# EAGLE design working (EAGLE 6.3)
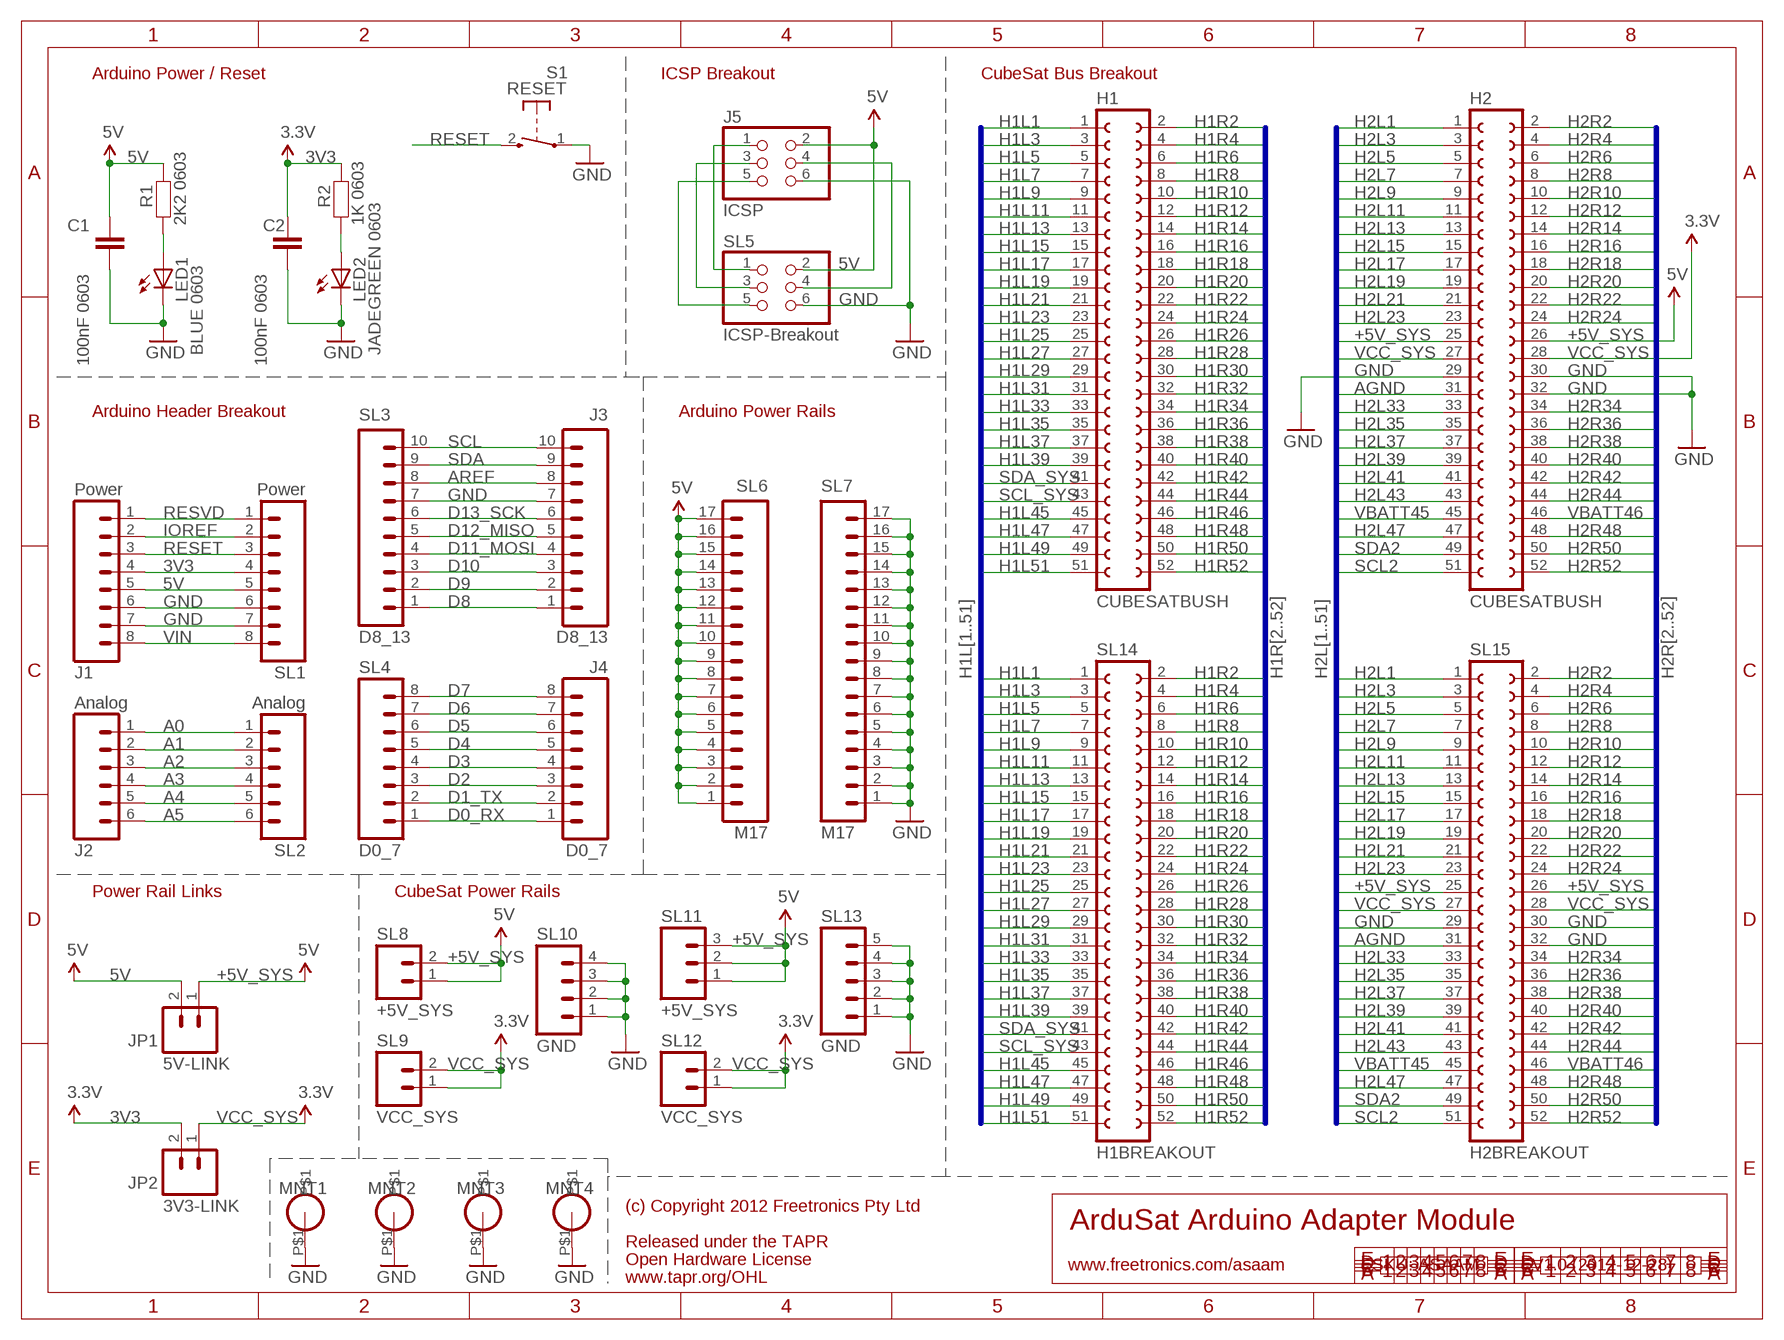
[diagram p0: schematic, sheet 1]

## Parts
C1  100nF 0603  CAP0603  [0603]
C2  100nF 0603  CAP0603  [0603]
H1  CUBESATBUSH  [CUBESATBUS]
H2  CUBESATBUSH  [CUBESATBUS]
J1  Power  M08STD  [1X08]
J2  Analog  M06SIP  [1X06]
J3  D8_13  M100.1  [1X10]
J4  D0_7  M08STD  [1X08]
J5  ICSP  ICSPPTH  [2X03PTH]
JP1  5V-LINK  M02PTH  [1X02]
JP2  3V3-LINK  M02PTH  [1X02]
LED1  BLUE 0603  LED0603  [LED-0603]
LED2  JADEGREEN 0603  LED0603  [LED-0603]
MNT1  HOLE3.2MM  [HOLE32]
MNT2  HOLE3.2MM  [HOLE32]
MNT3  HOLE3.2MM  [HOLE32]
MNT4  HOLE3.2MM  [HOLE32]
R1  2K2 0603  RESISTOR0603  [0603]
R2  1K 0603  RESISTOR0603  [0603]
S1  RESET  TAC_SWITCH_2PIN  [TACTILE_SWITCH_SMD_2PIN_TINY]
SL1  Power  M08STD  [1X08]
SL2  Analog  M06SIP  [1X06]
SL3  D8_13  M100.1  [1X10]
SL4  D0_7  M08STD  [1X08]
SL5  ICSP-Breakout  ICSPPTH  [2X03PTH]
SL6  M17  [1X17]
SL7  M17  [1X17]
SL8  +5V_SYS  M02PTH  [1X02]
SL9  VCC_SYS  M02PTH  [1X02]
SL10  GND  M04PTH  [1X04]
SL11  +5V_SYS  M03PTH  [1X03]
SL12  VCC_SYS  M02PTH  [1X02]
SL13  GND  M05PTH  [1X05]
SL14  H1BREAKOUT  CUBESATBUSH  [CUBESATBUS]
SL15  H2BREAKOUT  CUBESATBUSH  [CUBESATBUS]

## Nets
3V3: C2.1 J1.4 JP2.2 R2.1 SL1.4 ; supply symbol labelled 3.3V
5V: C1.1 J1.5 J5.2 JP1.2 R1.1 SL1.5 SL5.2 SL6.1 SL6.2 SL6.3 SL6.4 SL6.5 SL6.6 SL6.7 SL6.8 SL6.9 SL6.10 SL6.11 SL6.12 SL6.13 SL6.14 SL6.15 SL6.16 SL6.17
+5V_SYS: H2.25 H2.26 JP1.1 SL8.1 SL8.2 SL11.1 SL11.2 SL11.3 SL15.25 SL15.26 ; supply symbol labelled 5V
A0: J2.1 SL2.1
A1: J2.2 SL2.2
A2: J2.3 SL2.3
A3: J2.4 SL2.4
A4: J2.5 SL2.5
A5: J2.6 SL2.6
AGND: H2.31 SL15.31
AREF: J3.8 SL3.8
D0_RX: J4.1 SL4.1
D1_TX: J4.2 SL4.2
D2: J4.3 SL4.3
D3: J4.4 SL4.4
D4: J4.5 SL4.5
D5: J4.6 SL4.6
D6: J4.7 SL4.7
D7: J4.8 SL4.8
D8: J3.1 SL3.1
D9: J3.2 SL3.2
D10: J3.3 SL3.3
D11_MOSI: J3.4 SL3.4
D12_MISO: J3.5 SL3.5
D13_SCK: J3.6 SL3.6
GND: C1.2 C2.2 H2.29 H2.30 H2.32 J1.6 J1.7 J3.7 J5.6 LED1.C LED2.C MNT1.P$1 MNT2.P$1 MNT3.P$1 MNT4.P$1 S1.1(P) SL1.6 SL1.7 SL3.7 SL5.6 SL7.1 SL7.2 SL7.3 SL7.4 SL7.5 SL7.6 SL7.7 SL7.8 SL7.9 SL7.10 SL7.11 SL7.12 SL7.13 SL7.14 SL7.15 SL7.16 SL7.17 SL10.1 SL10.2 SL10.3 SL10.4 SL13.1 SL13.2 SL13.3 SL13.4 SL13.5 SL15.29 SL15.30 SL15.32
H1L1: H1.1 SL14.1
H1L3: H1.3 SL14.3
H1L5: H1.5 SL14.5
H1L7: H1.7 SL14.7
H1L9: H1.9 SL14.9
H1L11: H1.11 SL14.11
H1L13: H1.13 SL14.13
H1L15: H1.15 SL14.15
H1L17: H1.17 SL14.17
H1L19: H1.19 SL14.19
H1L21: H1.21 SL14.21
H1L23: H1.23 SL14.23
H1L25: H1.25 SL14.25
H1L27: H1.27 SL14.27
H1L29: H1.29 SL14.29
H1L31: H1.31 SL14.31
H1L33: H1.33 SL14.33
H1L35: H1.35 SL14.35
H1L37: H1.37 SL14.37
H1L39: H1.39 SL14.39
H1L45: H1.45 SL14.45
H1L47: H1.47 SL14.47
H1L49: H1.49 SL14.49
H1L51: H1.51 SL14.51
H1R2: H1.2 SL14.2
H1R4: H1.4 SL14.4
H1R6: H1.6 SL14.6
H1R8: H1.8 SL14.8
H1R10: H1.10 SL14.10
H1R12: H1.12 SL14.12
H1R14: H1.14 SL14.14
H1R16: H1.16 SL14.16
H1R18: H1.18 SL14.18
H1R20: H1.20 SL14.20
H1R22: H1.22 SL14.22
H1R24: H1.24 SL14.24
H1R26: H1.26 SL14.26
H1R28: H1.28 SL14.28
H1R30: H1.30 SL14.30
H1R32: H1.32 SL14.32
H1R34: H1.34 SL14.34
H1R36: H1.36 SL14.36
H1R38: H1.38 SL14.38
H1R40: H1.40 SL14.40
H1R42: H1.42 SL14.42
H1R44: H1.44 SL14.44
H1R46: H1.46 SL14.46
H1R48: H1.48 SL14.48
H1R50: H1.50 SL14.50
H1R52: H1.52 SL14.52
H2L1: H2.1 SL15.1
H2L3: H2.3 SL15.3
H2L5: H2.5 SL15.5
H2L7: H2.7 SL15.7
H2L9: H2.9 SL15.9
H2L11: H2.11 SL15.11
H2L13: H2.13 SL15.13
H2L15: H2.15 SL15.15
H2L17: H2.17 SL15.17
H2L19: H2.19 SL15.19
H2L21: H2.21 SL15.21
H2L23: H2.23 SL15.23
H2L33: H2.33 SL15.33
H2L35: H2.35 SL15.35
H2L37: H2.37 SL15.37
H2L39: H2.39 SL15.39
H2L41: H2.41 SL15.41
H2L43: H2.43 SL15.43
H2L47: H2.47 SL15.47
H2R2: H2.2 SL15.2
H2R4: H2.4 SL15.4
H2R6: H2.6 SL15.6
H2R8: H2.8 SL15.8
H2R10: H2.10 SL15.10
H2R12: H2.12 SL15.12
H2R14: H2.14 SL15.14
H2R16: H2.16 SL15.16
H2R18: H2.18 SL15.18
H2R20: H2.20 SL15.20
H2R22: H2.22 SL15.22
H2R24: H2.24 SL15.24
H2R34: H2.34 SL15.34
H2R36: H2.36 SL15.36
H2R38: H2.38 SL15.38
H2R40: H2.40 SL15.40
H2R42: H2.42 SL15.42
H2R44: H2.44 SL15.44
H2R48: H2.48 SL15.48
H2R50: H2.50 SL15.50
H2R52: H2.52 SL15.52
IOREF: J1.2 SL1.2
N$1: LED2.A R2.2
N$6: LED1.A R1.2
N$35: J5.4 SL5.4
N$51: J5.1 SL5.1
N$52: J5.3 SL5.3
N$53: J5.5 SL5.5
RESET: J1.3 S1.2(S) SL1.3
RESVD: J1.1 SL1.1
SCL: J3.10 SL3.10
SCL2: H2.51 SL15.51
SCL_SYS: H1.43 SL14.43
SDA: J3.9 SL3.9
SDA2: H2.49 SL15.49
SDA_SYS: H1.41 SL14.41
VBATT45: H2.45 SL15.45
VBATT46: H2.46 SL15.46
VCC_SYS: H2.27 H2.28 JP2.1 SL9.1 SL9.2 SL12.1 SL12.2 SL15.27 SL15.28 ; supply symbol labelled 3.3V
VIN: J1.8 SL1.8

## Buses
H1L[1..51]
H1R[2..52]
H2L[1..51]
H2R[2..52]

## Notes on the sheet
- Arduino Power / Reset | ICSP Breakout | CubeSat Bus Breakout
- Arduino Header Breakout | Arduino Power Rails
- Power Rail Links | CubeSat Power Rails
- (c) Copyright 2012 Freetronics Pty Ltd
- ArduSat Arduino Adapter Module
- Released under the TAPR
- Open Hardware License
- www.freetronics.com/asaam | SKU: ASAAM | V1.0 (2012-12-28)
- www.tapr.org/OHL

## Library data of the parts
C1 C2 = freetronics-master-v1.1:CAP: Capacitor Standard 0603 ceramic capacitor, and 0.1" leaded capacitor.
H1 H2 SL14 SL15 = freetronics-jon:CUBESATBUS
J1 J4 SL1 SL4 = freetronics-master-v1.1:M08: Header 8 Standard 8-pin 0.1" header. Use with straight break away headers (SKU : PRT-00116), right angle break away headers (PRT-00553), swiss pins (PRT-00743), machine pins (PRT-00117), and female headers (PRT-00115).
J2 SL2 = freetronics-master-v1.1:M06: Header 6 Standard 6-pin 0.1" header. Use with straight break away headers (SKU : PRT-00116), right angle break away headers (PRT-00553), swiss pins (PRT-00743), machine pins (PRT-00117), and female headers (PRT-00115). Molex polarized connector foot print use with SKU : PRT-08094 with associated crimp pins and housings. NOTES ON THE VARIANTS LOCK and LOCK_LONGPADS... This footprint was designed to help hold the alignment of a through-hole component (i.e. 6-pin header) while soldering it into place. You may notice that each hole has been shifted either up or down by 0.005 of an inch from it's more standard position (which is a perfectly straight line). This slight alteration caused the pins (the squares in the middle) to touch the edges of the holes. Because they are alternating, it causes a "brace" to hold the component in place. 0.005 has proven to be the perfect amount of "off-center" position when using our standard breakaway headers. Although looks a little odd when you look at the bare footprint, once you have a header in there, the alteration is very hard to notice. Also, if you push a header all the way into place, it is covered up entirely on the bottom side. This idea of altering the position of holes to aid alignment will be further integrated into the Sparkfun Library for other footprints. It can help hold any component with 3 or more connection pins.
J3 SL3 = freetronics-original:M10: Header 10 Standard 10-pin 0.1" header. Use with straight break away headers (SKU : PRT-00116), right angle break away headers (PRT-00553), swiss pins (PRT-00743), machine pins (PRT-00117), and female headers (PRT-00115).
J5 SL5 = freetronics-jon:ICSP
JP1 JP2 SL8 SL9 SL12 = freetronics-master-v1.1:M02: Header 2 Standard 2-pin 0.1" header. Use with straight break away headers (SKU : PRT-00116), right angle break away headers (PRT-00553), swiss pins (PRT-00743), machine pins (PRT-00117), and female headers (PRT-00115). Molex polarized connector foot print use with SKU : PRT-08233 with associated crimp pins and housings.
LED1 LED2 = freetronics-jon:LED: LEDs Standard schematic elements and footprints for 5mm, 3mm, 1206, and 0603 sized LEDs. 5mm - Spark Fun Electronics SKU : COM-00529 (and others)
MNT1-MNT4 = freetronics-jon:HOLE
R1 R2 = freetronics-master-v1.1:RESISTOR: Resistor Basic schematic elements and footprints for 0603, 1206, and PTH 1/10th watt (small) resistors.
S1 = freetronics-master-v1:TAC_SWITCH_2PIN: Momentary Tactile Switch - 2 pin
SL6 SL7 = freetronics-master-v1.1:M17
SL10 = freetronics-master-v1.1:M04: Header 4 Standard 4-pin 0.1" header. Use with straight break away headers (SKU : PRT-00116), right angle break away headers (PRT-00553), swiss pins (PRT-00743), machine pins (PRT-00117), and female headers (PRT-00115). Molex polarized connector foot print use with SKU : PRT-08231 with associated crimp pins and housings.
SL11 = freetronics-master-v1.1:M03: Header 3 Standard 3-pin 0.1" header. Use with straight break away headers (SKU : PRT-00116), right angle break away headers (PRT-00553), swiss pins (PRT-00743), machine pins (PRT-00117), and female headers (PRT-00115). Molex polarized connector foot print use with SKU : PRT-08232 with associated crimp pins and housings.
SL13 = freetronics-master-v1.1:M05: Header 5 Standard 5-pin 0.1" header. Use with straight break away headers (SKU : PRT-00116), right angle break away headers (PRT-00553), swiss pins (PRT-00743), machine pins (PRT-00117), and female headers (PRT-00115). Molex polarized connector foot print use with SKU : PRT-08230 with associated crimp pins and housings.

## Board
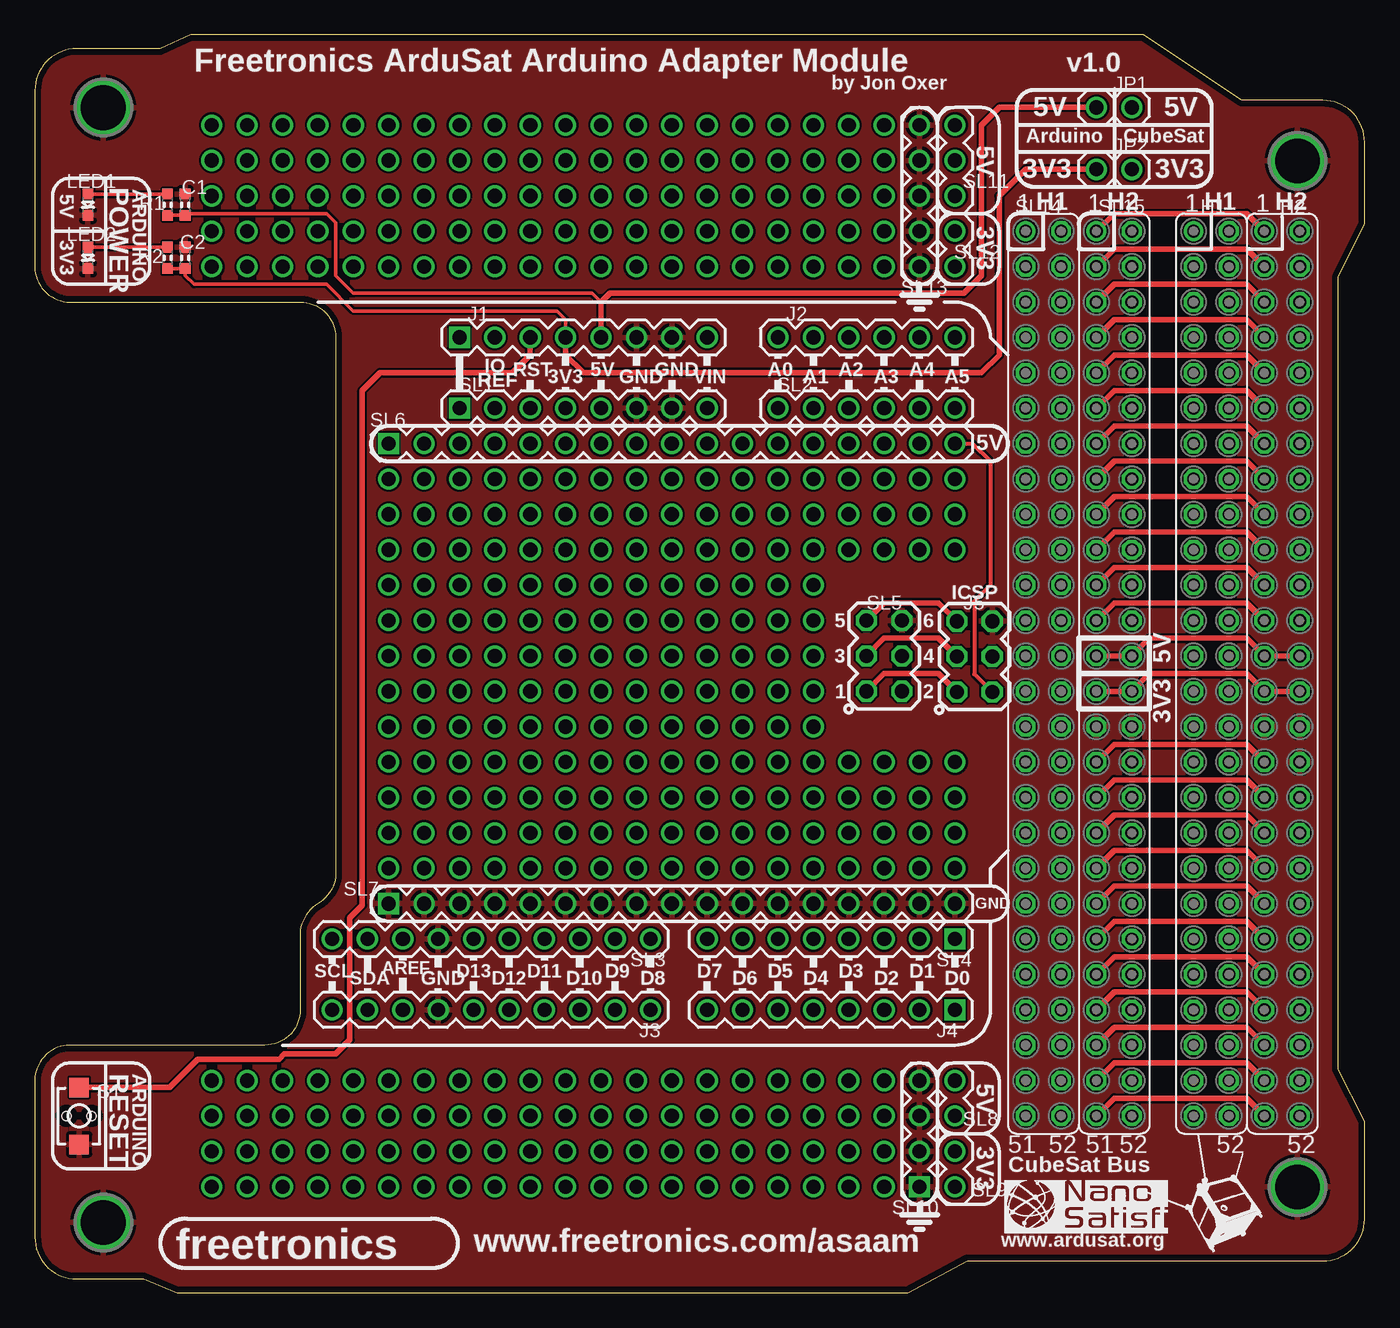
[diagram p1: board, top side]
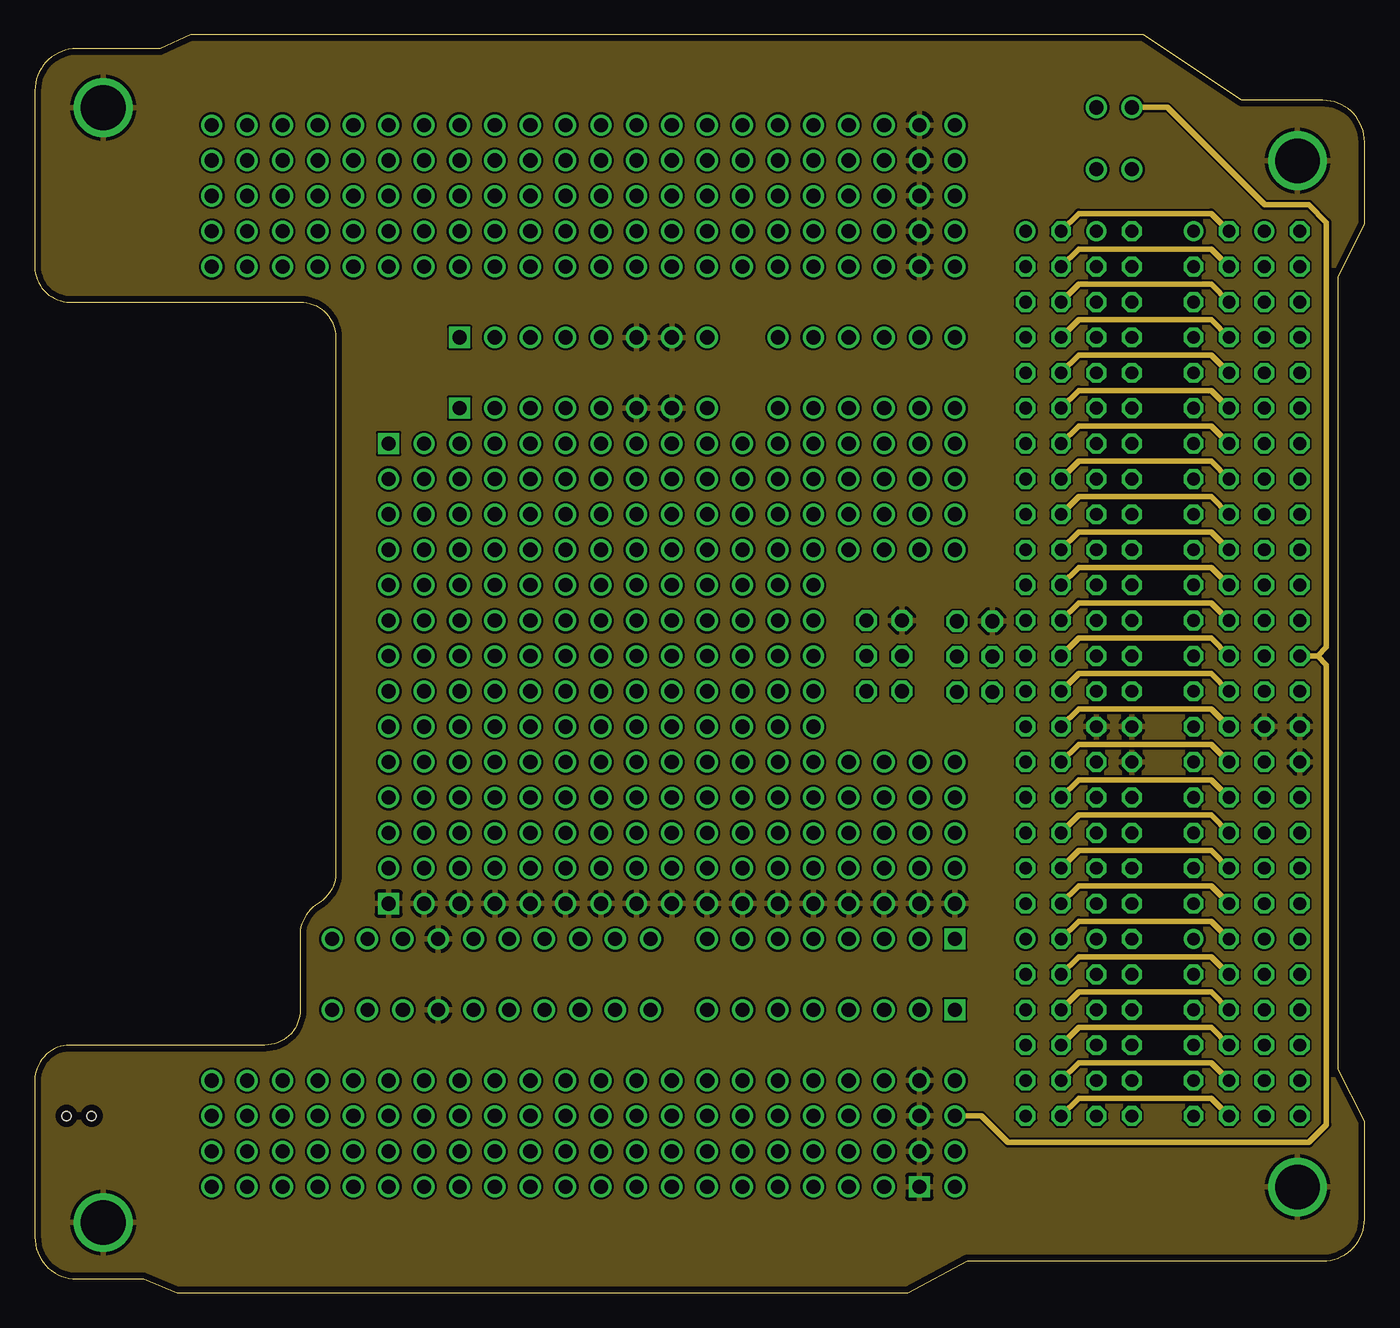
[diagram p2: board, inner layer Route2]
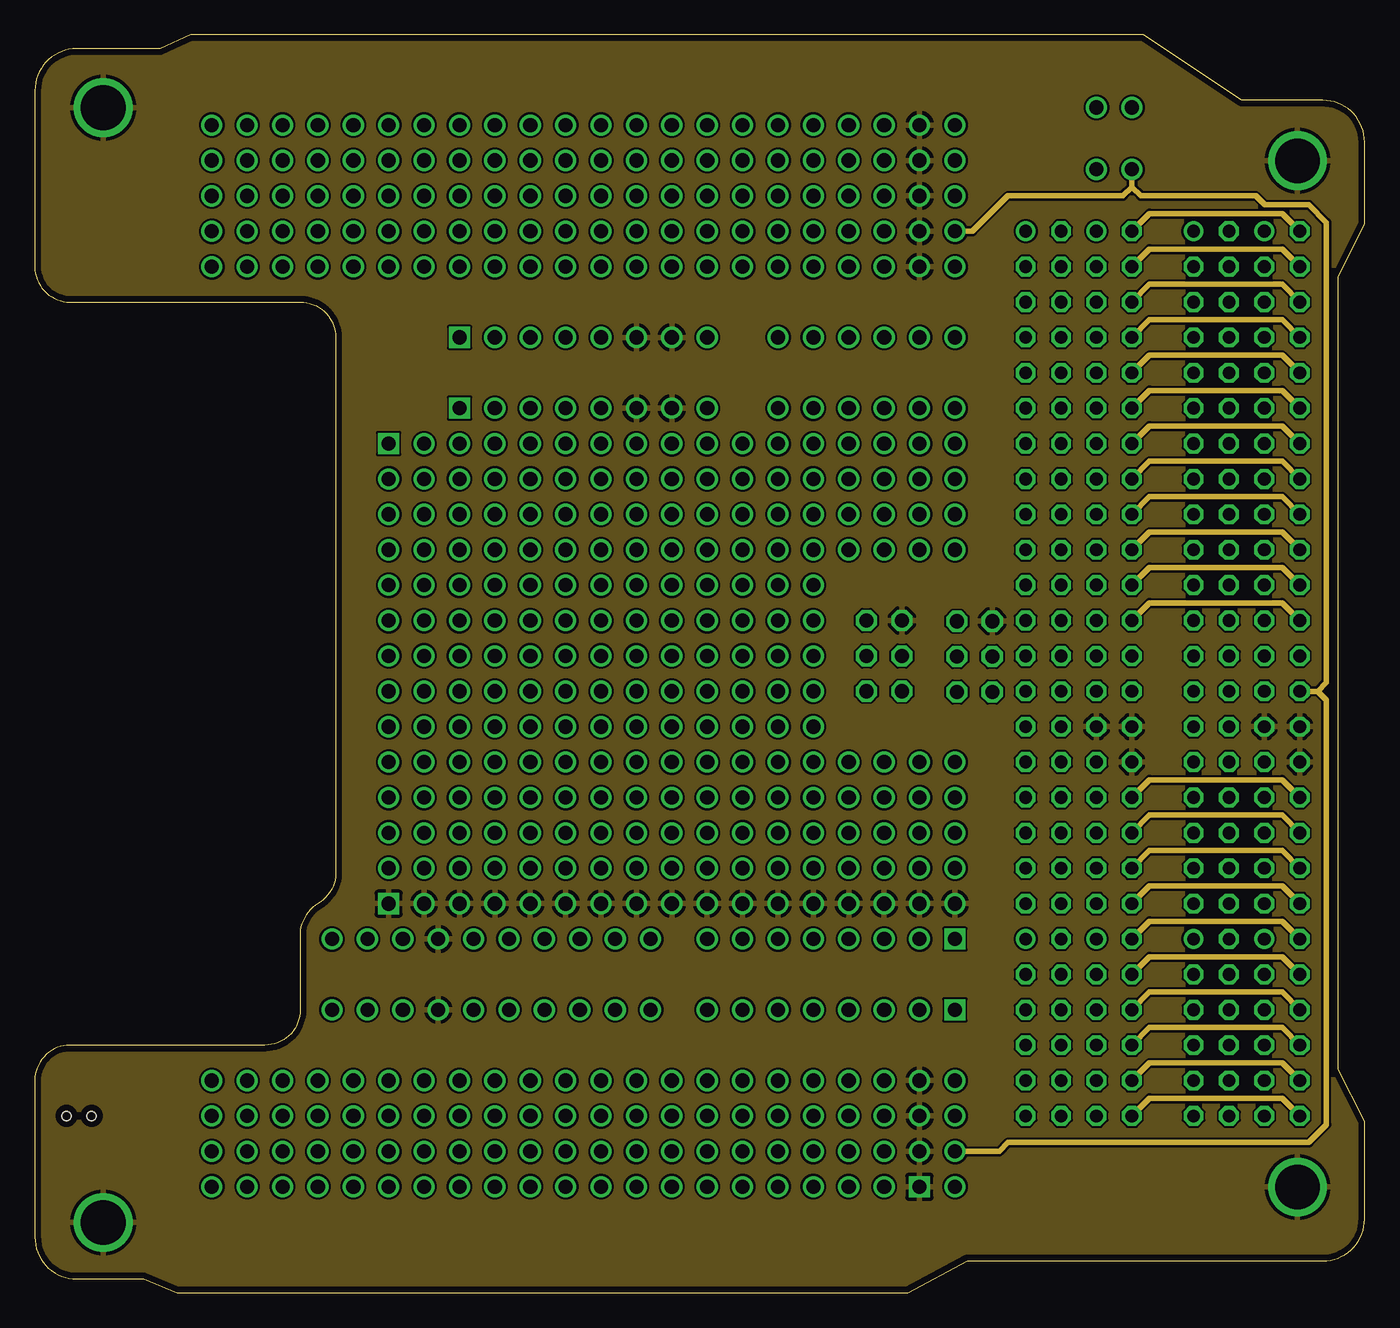
[diagram p3: board, inner layer Route15]
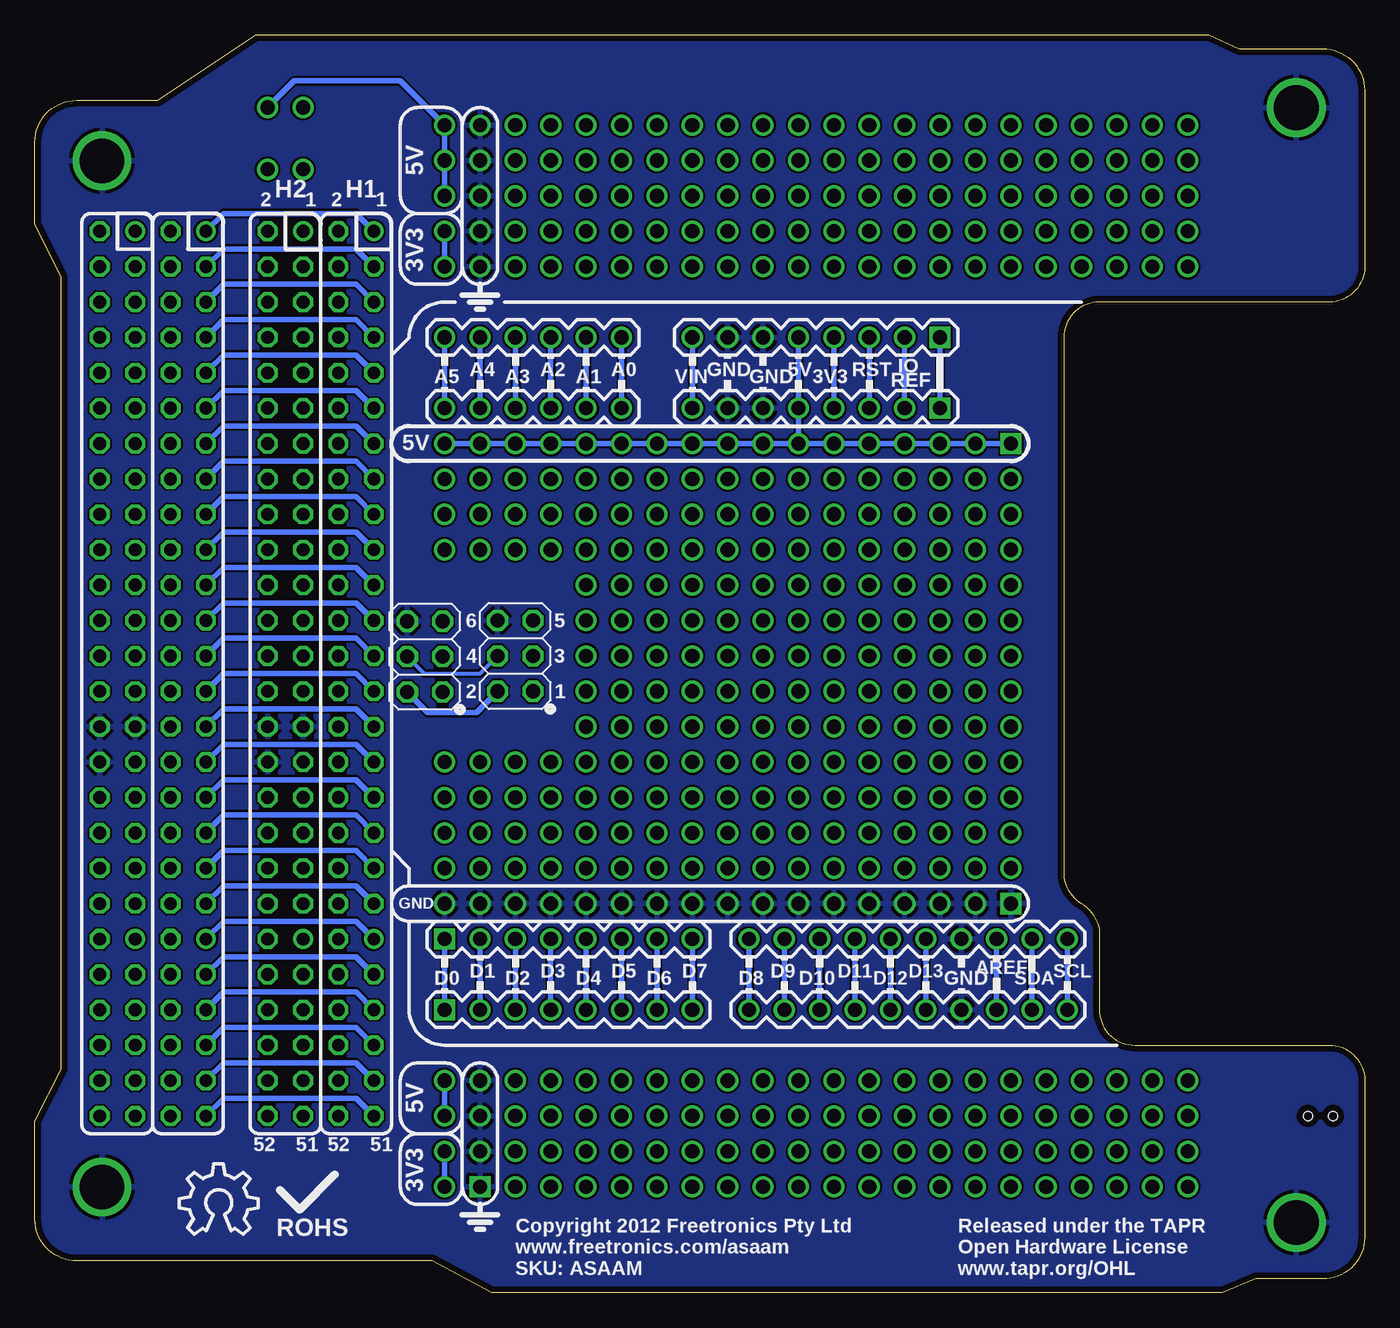
[diagram p4: board, bottom side, seen from below]

Size 95.45 x 90.3 mm. Coordinates in mm from the lower left corner, seen from the top.
Outline: 0,4 arc90 3,1 7.81,1 10.23,0 62.65,0 66.94,2.3 92.45,2.3 arc90 95.45,5.3 95.45,12.31 93.55,16.05 93.55,72.91 95.45,76.74 95.45,82.6 arc90 92.45,85.6 86.64,85.6 79.56,90.3 11.2,90.3 9,89.3 3,89.3 arc90 0,86.3 0,73.66 arc90 2.54,71.12 19.05,71.12 arc-90 21.59,68.58 21.59,29.84 arc-50 20.32,27.94 arc50 19.05,26.04 19.05,20.32 arc-90 16.51,17.78 2.54,17.78 arc90 0,15.24 0,4
Copper layers (1+2*15+16): Top 0.035mm / dielectric 1.5mm / Route2 0.035mm / dielectric 0.15mm / Route15 0.035mm / dielectric 0.2mm / Bottom 0.035mm
Design rules "default *": minimum track width 6mil, minimum drill 24mil, track to track 6mil, track to pad 12mil, pad to pad 12mil, via to via 12mil, smd to smd 8mil, copper to edge 18mil, drill to drill 8mil, minimum pad ring 10mil, minimum via ring 8mil, stop-mask expansion 4mil, vias tented up to drill 0mil, thermal gap 10mil

### Footprints (pad centres in the part's own frame; a part is rotated, then mirrored left to right if it is on the bottom)
0603 = smd 0.762 x 0.762: 1 -0.762,0; 2 0.762,0
CUBESATBUS = drill 0.914: 1 -31.75,-1.27; 41 19.05,-1.27 | drill 0.914 octagon: 2 -31.75,1.27; 3 -29.21,-1.27; 4 -29.21,1.27; 5 -26.67,-1.27; 6 -26.67,1.27; 7 -24.13,-1.27; 8 -24.13,1.27; 9 -21.59,-1.27; 10 -21.59,1.27; 11 -19.05,-1.27; 12 -19.05,1.27; 13 -16.51,-1.27; 14 -16.51,1.27; 15 -13.97,-1.27; 16 -13.97,1.27; 17 -11.43,-1.27; 18 -11.43,1.27; 19 -8.89,-1.27; 20 -8.89,1.27; 21 -6.35,-1.27; 22 -6.35,1.27; 23 -3.81,-1.27; 24 -3.81,1.27; 25 -1.27,-1.27; 26 -1.27,1.27; 27 1.27,-1.27; 28 1.27,1.27; 29 3.81,-1.27; 30 3.81,1.27; 31 6.35,-1.27; 32 6.35,1.27; 33 8.89,-1.27; 34 8.89,1.27; 35 11.43,-1.27; 36 11.43,1.27; 37 13.97,-1.27; 38 13.97,1.27; 39 16.51,-1.27; 40 16.51,1.27; 42 19.05,1.27; 43 21.59,-1.27; 44 21.59,1.27; 45 24.13,-1.27; 46 24.13,1.27; 47 26.67,-1.27; 48 26.67,1.27; 49 29.21,-1.27; 50 29.21,1.27; 51 31.75,-1.27; 52 31.75,1.27
1X08 = drill 1.016 square: 1 0,0 | drill 1.016: 2 2.54,0; 3 5.08,0; 4 7.62,0; 5 10.16,0; 6 12.7,0; 7 15.24,0; 8 17.78,0
1X06 = drill 1.016: 1 0,0; 2 2.54,0; 3 5.08,0; 4 7.62,0; 5 10.16,0; 6 12.7,0
1X10 = drill 1.016: 1 0,0; 2 2.54,0; 3 5.08,0; 4 7.62,0; 5 10.16,0; 6 12.7,0; 7 15.24,0; 8 17.78,0; 9 20.32,0; 10 22.86,0
2X03PTH = drill 1.016 octagon: 1 -2.54,-1.27; 2 -2.54,1.27; 3 0,-1.27; 4 0,1.27; 5 2.54,-1.27; 6 2.54,1.27
1X02 = drill 1.016: 1 0,0; 2 2.54,0
LED-0603 = smd 0.762 x 0.762: A -0.762,0; C 0.762,0
HOLE32 = drill 3.2: P$1 0,0
TACTILE_SWITCH_SMD_2PIN_TINY = smd 1.4 x 1.4: 1 -2.05,0; 2 2.05,0 | hole 0.65: 0,0.9; 0,-0.9
1X17 = drill 1.016 square: 1 0,0 | drill 1.016: 2 2.54,0; 3 5.08,0; 4 7.62,0; 5 10.16,0; 6 12.7,0; 7 15.24,0; 8 17.78,0; 9 20.32,0; 10 22.86,0; 11 25.4,0; 12 27.94,0; 13 30.48,0; 14 33.02,0; 15 35.56,0; 16 38.1,0; 17 40.64,0
1X04 = drill 1.016 square: 1 0,0 | drill 1.016: 2 2.54,0; 3 5.08,0; 4 7.62,0
1X03 = drill 1.016: 1 0,0; 2 2.54,0; 3 5.08,0
1X05 = drill 1.016: 1 0,0; 2 2.54,0; 3 5.08,0; 4 7.62,0; 5 10.16,0

### Placement (x,y rotation side)
C1  10.79,78.11 90 top
C2  10.79,74.3 90 top
H1  84.44,44.45 270 top
H2  89.52,44.45 270 top
J1  30.48,68.58 0 top
J2  53.34,68.58 0 top
J3  44.2,20.32 180 top
J4  66.04,20.32 180 top
J5  67.45,45.67 90 bottom
JP1  78.74,85.09 180 top
JP2  78.74,80.64 180 top
LED1  3.81,78.11 270 top
LED2  3.81,74.3 270 top
MNT1  90.63,81.26 0 top
MNT2  90.63,7.6 0 top
MNT3  4.91,85.07 0 top
MNT4  4.91,5.05 0 top
R1  9.53,78.11 90 top
R2  9.53,74.3 90 top
S1  3.17,12.7 90 top
SL1  30.48,63.5 0 top
SL2  53.34,63.5 0 top
SL3  44.2,25.4 180 top
SL4  66.04,25.4 180 top
SL5  60.96,45.72 90 bottom
SL6  25.4,60.96 0 top
SL7  25.4,27.94 0 top
SL8  66.04,12.7 90 top
SL9  66.04,7.62 90 top
SL10  63.5,7.62 90 top
SL11  66.04,78.74 90 top
SL12  66.04,73.66 90 top
SL13  63.5,73.66 90 top
SL14  72.39,44.45 270 top
SL15  77.47,44.45 270 top
U$5  [OSHW_10X200_NOTEXT]  85.09,4.19 0 bottom

### Tracks (layer width: path | path; a pad name or v marks a point on that pad's centre or on a via)
3V3
  Top 0.254: R2.1 C2.1 10.79,73.03 11.43,72.39 20.95,72.39 22.86,70.48 37.47,70.48 38.1,69.85 J1.4
  Top 0.406: JP2.2 71.12,80.64 69.22,78.74 69.22,67.31 67.94,66.04 39.37,66.04 38.1,67.31 J1.4
  Bottom 0.406: J1.4 SL1.4
5V
  Top 0.254: R1.1 C1.1 10.29,77.34 10.79,77.47 20.95,77.47 21.59,76.83 21.59,73.03 22.86,71.75 40.01,71.75 40.64,71.12
  Top 0.305: SL6.17 67.31,60.96 68.58,59.69 68.58,50.8 67.44,49.66 67.44,44.41 J5.2
  Top 0.406: JP1.2 69.22,85.09 67.94,83.82 67.94,73.03 66.67,71.75 41.27,71.75 40.64,71.12 J1.5
  Bottom 0.406: J1.5 SL1.5 SL6.7 | J5.2 67.25,41.66 63.75,41.66 SL5.2 | SL6.1 SL6.2 SL6.3 SL6.4 SL6.5 SL6.6 SL6.7 | SL6.7 SL6.8 SL6.9 SL6.10 SL6.11 SL6.12 SL6.13 SL6.14 SL6.15 SL6.16 SL6.17
+5V_SYS
  Top 0.406: SL15.25 SL15.26 80.01,46.99 86.98,46.99 H2.25 H2.26
  Route2 0.406: JP1.1 81.28,85.09 88.27,78.11 91.44,78.11 92.71,76.83 92.71,46.35 92.08,45.72 | 92.08,45.72 H2.26 | SL8.1 67.94,12.7 69.85,10.79 91.44,10.79 92.71,12.06 92.71,45.09 92.08,45.72
  Bottom 0.406: JP1.1 76.83,87 69.22,87 SL11.3 SL11.2 SL11.1 | SL8.1 SL8.2
A0
  Bottom 0.406: J2.1 SL2.1
A1
  Bottom 0.406: J2.2 SL2.2
A2
  Bottom 0.406: J2.3 SL2.3
A3
  Bottom 0.406: J2.4 SL2.4
A4
  Bottom 0.406: SL2.5 J2.5
A5
  Bottom 0.406: J2.6 SL2.6
AGND
  Top 0.406: SL15.31 77.47,39.37 86.98,39.37 H2.31
AREF
  Bottom 0.406: SL3.8 J3.8
D0_RX
  Bottom 0.406: SL4.1 J4.1
D1_TX
  Bottom 0.406: J4.2 SL4.2
D2
  Bottom 0.406: SL4.3 J4.3
D3
  Bottom 0.406: J4.4 SL4.4
D4
  Bottom 0.406: SL4.5 J4.5
D5
  Bottom 0.406: J4.6 SL4.6
D6
  Bottom 0.406: SL4.7 J4.7
D7
  Bottom 0.406: J4.8 SL4.8
D8
  Bottom 0.406: SL3.1 J3.1
D9
  Bottom 0.406: J3.2 SL3.2
D10
  Bottom 0.406: SL3.3 J3.3
D11_MOSI
  Bottom 0.406: J3.4 SL3.4
D12_MISO
  Bottom 0.406: SL3.5 J3.5
D13_SCK
  Bottom 0.406: J3.6 SL3.6
GND
  pour Bottom: 0,86.3 arc-90 3,89.3 9,89.3 11.2,90.3 79.56,90.3 86.64,85.6 92.45,85.6 arc-90 95.45,82.6 95.45,76.74 93.55,72.91 93.55,16.05 95.45,12.31 95.45,5.08 arc-90 92.45,2.3 66.94,2.3 62.65,0 10.16,0 7.81,1 3,1 arc-90 0,4 0,15.24 arc-90 2.54,17.78 16.51,17.78 arc90 19.05,20.32 19.05,26.04 arc-50 20.32,27.94 arc50 21.59,29.84 21.59,68.58 arc90 19.05,71.12 2.54,71.12 arc-90 0,73.66
  pour Top: 0,86.3 arc-90 3,89.3 9,89.3 11.2,90.3 79.56,90.3 86.64,85.6 92.45,85.6 arc-90 95.45,82.6 95.45,76.74 93.55,72.91 93.55,16.05 95.45,12.31 95.45,5.08 arc-90 92.45,2.3 66.94,2.3 62.65,0 10.16,0 7.81,1 3,1 arc-90 0,4 0,15.24 arc-90 2.54,17.78 16.51,17.78 arc90 19.05,20.32 19.05,26.04 arc-50 20.32,27.94 arc50 21.59,29.84 21.59,68.58 arc90 19.05,71.12 2.54,71.12 arc-90 0,73.6
  pour Route15: 0,86.3 arc-90 3,89.3 9,89.3 11.2,90.3 79.56,90.3 86.64,85.6 92.45,85.6 arc-90 95.45,82.6 95.45,76.74 93.55,72.91 93.55,16.05 95.45,12.31 95.45,5.08 arc-90 92.45,2.3 66.94,2.3 62.65,0 10.16,0 7.81,1 3,1 arc-90 0,4 0,15.24 arc-90 2.54,17.78 16.51,17.78 arc90 19.05,20.32 19.05,26.04 arc-50 20.32,27.94 arc50 21.59,29.84 21.59,68.58 arc90 19.05,71.12 2.54,71.12 arc-90 0,73.66
  pour Route2: 0,86.3 arc-90 3,89.3 9,89.3 11.2,90.3 79.56,90.3 86.64,85.6 92.45,85.6 arc-90 95.45,82.6 95.45,76.74 93.55,72.91 93.55,16.05 95.45,12.31 95.45,5.08 arc-90 92.45,2.3 66.94,2.3 62.65,0 10.16,0 7.81,1 3,1 arc-90 0,4 0,15.24 arc-90 2.54,17.78 16.51,17.78 arc90 19.05,20.32 19.05,26.04 arc-50 20.32,27.94 arc50 21.59,29.84 21.59,68.58 arc90 19.05,71.12 2.54,71.12 arc-90 0,73.66
H1L1
  Bottom 0.406: SL14.1 72.39,77.47 81.9,77.47 H1.1
H1L3
  Bottom 0.406: SL14.3 72.39,74.93 81.9,74.93 H1.3
H1L5
  Bottom 0.406: SL14.5 72.39,72.39 81.9,72.39 H1.5
H1L7
  Bottom 0.406: SL14.7 72.39,69.85 81.9,69.85 H1.7
H1L9
  Bottom 0.406: SL14.9 72.39,67.31 81.9,67.31 H1.9
H1L11
  Bottom 0.406: SL14.11 72.39,64.77 81.9,64.77 H1.11
H1L13
  Bottom 0.406: SL14.13 72.39,62.23 81.9,62.23 H1.13
H1L15
  Bottom 0.406: SL14.15 72.39,59.69 81.9,59.69 H1.15
H1L17
  Bottom 0.406: SL14.17 72.39,57.15 81.9,57.15 H1.17
H1L19
  Bottom 0.406: SL14.19 72.39,54.61 81.9,54.61 H1.19
H1L21
  Bottom 0.406: SL14.21 72.39,52.07 81.9,52.07 H1.21
H1L23
  Bottom 0.406: SL14.23 72.39,49.53 81.9,49.53 H1.23
H1L25
  Bottom 0.406: SL14.25 72.39,46.99 81.9,46.99 H1.25
H1L27
  Bottom 0.406: SL14.27 72.39,44.45 81.9,44.45 H1.27
H1L29
  Bottom 0.406: SL14.29 72.39,41.91 81.9,41.91 H1.29
H1L31
  Bottom 0.406: SL14.31 72.39,39.37 81.9,39.37 H1.31
H1L33
  Bottom 0.406: SL14.33 72.39,36.83 81.9,36.83 H1.33
H1L35
  Bottom 0.406: SL14.35 72.39,34.29 81.9,34.29 H1.35
H1L37
  Bottom 0.406: SL14.37 72.39,31.75 81.9,31.75 H1.37
H1L39
  Bottom 0.406: SL14.39 72.39,29.21 81.9,29.21 H1.39
H1L45
  Bottom 0.406: SL14.45 72.39,21.59 81.9,21.59 H1.45
H1L47
  Bottom 0.406: SL14.47 72.39,19.05 81.9,19.05 H1.47
H1L49
  Bottom 0.406: SL14.49 72.39,16.51 81.9,16.51 H1.49
H1L51
  Bottom 0.406: SL14.51 72.39,13.97 81.9,13.97 H1.51
H1R2
  Route2 0.406: SL14.2 74.93,77.47 84.44,77.47 H1.2
H1R4
  Route2 0.406: SL14.4 74.93,74.93 84.44,74.93 H1.4
H1R6
  Route2 0.406: SL14.6 74.93,72.39 84.44,72.39 H1.6
H1R8
  Route2 0.406: SL14.8 74.93,69.85 84.44,69.85 H1.8
H1R10
  Route2 0.406: SL14.10 74.93,67.31 84.44,67.31 H1.10
H1R12
  Route2 0.406: SL14.12 74.93,64.77 84.44,64.77 H1.12
H1R14
  Route2 0.406: SL14.14 74.93,62.23 84.44,62.23 H1.14
H1R16
  Route2 0.406: SL14.16 74.93,59.69 84.44,59.69 H1.16
H1R18
  Route2 0.406: SL14.18 74.93,57.15 84.44,57.15 H1.18
H1R20
  Route2 0.406: SL14.20 74.93,54.61 84.44,54.61 H1.20
H1R22
  Route2 0.406: SL14.22 74.93,52.07 84.44,52.07 H1.22
H1R24
  Route2 0.406: SL14.24 74.93,49.53 84.44,49.53 H1.24
H1R26
  Route2 0.406: SL14.26 74.93,46.99 84.44,46.99 H1.26
H1R28
  Top 0.152: H1.28
  Route2 0.406: SL14.28 74.93,44.45 84.44,44.45 H1.28
H1R30
  Route2 0.406: SL14.30 74.93,41.91 84.44,41.91 H1.30
H1R32
  Route2 0.406: SL14.32 74.93,39.37 84.44,39.37 H1.32
H1R34
  Route2 0.406: SL14.34 74.93,36.83 84.44,36.83 H1.34
H1R36
  Route2 0.406: SL14.36 74.93,34.29 84.44,34.29 H1.36
H1R38
  Route2 0.406: SL14.38 74.93,31.75 84.44,31.75 H1.38
H1R40
  Route2 0.406: SL14.40 74.93,29.21 84.44,29.21 H1.40
H1R42
  Route2 0.406: SL14.42 74.93,26.67 84.44,26.67 H1.42
H1R44
  Route2 0.406: SL14.44 74.93,24.13 84.44,24.13 H1.44
H1R46
  Route2 0.406: SL14.46 74.93,21.59 84.44,21.59 H1.46
H1R48
  Route2 0.406: SL14.48 74.93,19.05 84.44,19.05 H1.48
H1R50
  Route2 0.406: SL14.50 74.93,16.51 84.44,16.51 H1.50
H1R52
  Route2 0.406: SL14.52 74.93,13.97 84.44,13.97 H1.52
H2L1
  Top 0.406: SL15.1 77.47,77.47 86.98,77.47 H2.1
H2L3
  Top 0.406: SL15.3 77.47,74.93 86.98,74.93 H2.3
H2L5
  Top 0.406: SL15.5 77.47,72.39 86.98,72.39 H2.5
H2L7
  Top 0.406: SL15.7 77.47,69.85 86.98,69.85 H2.7
H2L9
  Top 0.406: SL15.9 77.47,67.31 86.98,67.31 H2.9
H2L11
  Top 0.406: SL15.11 77.47,64.77 86.98,64.77 H2.11
H2L13
  Top 0.406: SL15.13 77.47,62.23 86.98,62.23 H2.13
H2L15
  Top 0.406: SL15.15 77.47,59.69 86.98,59.69 H2.15
H2L17
  Top 0.406: SL15.17 77.47,57.15 86.98,57.15 H2.17
H2L19
  Top 0.406: SL15.19 77.47,54.61 86.98,54.61 H2.19
H2L21
  Top 0.406: SL15.21 77.47,52.07 86.98,52.07 H2.21
H2L23
  Top 0.406: SL15.23 77.47,49.53 86.98,49.53 H2.23
H2L33
  Top 0.406: SL15.33 77.47,36.83 86.98,36.83 H2.33
H2L35
  Top 0.406: SL15.35 77.47,34.29 86.98,34.29 H2.35
H2L37
  Top 0.406: SL15.37 77.47,31.75 86.98,31.75 H2.37
H2L39
  Top 0.406: SL15.39 77.47,29.21 86.98,29.21 H2.39
H2L41
  Top 0.406: SL15.41 77.47,26.67 86.98,26.67 H2.41
H2L43
  Top 0.406: SL15.43 77.47,24.13 86.98,24.13 H2.43
H2L47
  Top 0.406: SL15.47 77.47,19.05 86.98,19.05 H2.47
H2R2
  Route15 0.406: SL15.2 80.01,77.47 89.52,77.47 H2.2
H2R4
  Route15 0.406: SL15.4 80.01,74.93 89.52,74.93 H2.4
H2R6
  Route15 0.406: SL15.6 80.01,72.39 89.52,72.39 H2.6
H2R8
  Route15 0.406: SL15.8 80.01,69.85 89.52,69.85 H2.8
H2R10
  Route15 0.406: SL15.10 80.01,67.31 89.52,67.31 H2.10
H2R12
  Route15 0.406: SL15.12 80.01,64.77 89.52,64.77 H2.12
H2R14
  Route15 0.406: SL15.14 80.01,62.23 89.52,62.23 H2.14
H2R16
  Route15 0.406: SL15.16 80.01,59.69 89.52,59.69 H2.16
H2R18
  Route15 0.406: SL15.18 80.01,57.15 89.52,57.15 H2.18
H2R20
  Route15 0.406: SL15.20 80.01,54.61 89.52,54.61 H2.20
H2R22
  Route15 0.406: SL15.22 80.01,52.07 89.52,52.07 H2.22
H2R24
  Route15 0.406: SL15.24 80.01,49.53 89.52,49.53 H2.24
H2R34
  Route15 0.406: SL15.34 80.01,36.83 89.52,36.83 H2.34
H2R36
  Route15 0.406: SL15.36 80.01,34.29 89.52,34.29 H2.36
H2R38
  Route15 0.406: SL15.38 80.01,31.75 89.52,31.75 H2.38
H2R40
  Route15 0.406: SL15.40 80.01,29.21 89.52,29.21 H2.40
H2R42
  Route15 0.406: SL15.42 80.01,26.67 89.52,26.67 H2.42
H2R44
  Route15 0.406: SL15.44 80.01,24.13 89.52,24.13 H2.44
H2R48
  Route15 0.406: SL15.48 80.01,19.05 89.52,19.05 H2.48
H2R50
  Route15 0.406: SL15.50 80.01,16.51 89.52,16.51 H2.50
H2R52
  Route15 0.406: SL15.52 80.01,13.97 89.52,13.97 H2.52
IOREF
  Bottom 0.406: J1.2 SL1.2
N$1
  Top 0.254: LED2.A R2.2
N$2  (via drill 1.02)
  other vias: 25.4,35.56
N$3  (via drill 1.02)
  other vias: 50.8,35.56
N$4  (via drill 1.02)
  other vias: 48.26,35.56
N$5  (via drill 1.02)
  other vias: 45.72,35.56
N$6
  Top 0.254: LED1.A R1.2
N$7  (via drill 1.02)
  other vias: 43.18,35.56
N$8  (via drill 1.02)
  other vias: 40.64,35.56
N$9  (via drill 1.02)
  other vias: 38.1,35.56
N$10  (via drill 1.02)
  other vias: 35.56,35.56
N$11  (via drill 1.02)
  other vias: 33.02,35.56
N$12  (via drill 1.02)
  other vias: 30.48,35.56
N$13  (via drill 1.02)
  other vias: 27.94,35.56
N$14  (via drill 1.02)
  other vias: 25.4,33.02
N$15  (via drill 1.02)
  other vias: 25.4,30.48
N$16  (via drill 1.02)
  other vias: 50.8,33.02
N$17  (via drill 1.02)
  other vias: 48.26,33.02
N$18  (via drill 1.02)
  other vias: 45.72,33.02
N$19  (via drill 1.02)
  other vias: 43.18,33.02
N$20  (via drill 1.02)
  other vias: 40.64,33.02
N$21  (via drill 1.02)
  other vias: 38.1,33.02
N$22  (via drill 1.02)
  other vias: 35.56,33.02
N$23  (via drill 1.02)
  other vias: 33.02,33.02
N$24  (via drill 1.02)
  other vias: 30.48,33.02
N$25  (via drill 1.02)
  other vias: 27.94,33.02
N$26  (via drill 1.02)
  other vias: 50.8,30.48
N$27  (via drill 1.02)
  other vias: 48.26,30.48
N$28  (via drill 1.02)
  other vias: 45.72,30.48
N$29  (via drill 1.02)
  other vias: 43.18,30.48
N$30  (via drill 1.02)
  other vias: 40.64,30.48
N$31  (via drill 1.02)
  other vias: 38.1,30.48
N$32  (via drill 1.02)
  other vias: 35.56,30.48
N$33  (via drill 1.02)
  other vias: 33.02,30.48
N$34  (via drill 1.02)
  other vias: 55.88,40.64
N$35
  Bottom 0.305: J5.4 67.5,44.45 63.5,44.45 SL5.4
N$36  (via drill 1.02)
  other vias: 30.48,30.48
N$37  (via drill 1.02)
  other vias: 27.94,30.48
N$38  (via drill 1.02)
  other vias: 50.8,38.1
N$39  (via drill 1.02)
  other vias: 48.26,38.1
N$40  (via drill 1.02)
  other vias: 45.72,38.1
N$41  (via drill 1.02)
  other vias: 43.18,38.1
N$42  (via drill 1.02)
  other vias: 53.34,35.56
N$43  (via drill 1.02)
  other vias: 53.34,33.02
N$44  (via drill 1.02)
  other vias: 53.34,30.48
N$45  (via drill 1.02)
  other vias: 25.4,38.1
N$46  (via drill 1.02)
  other vias: 40.64,38.1
N$47  (via drill 1.02)
  other vias: 38.1,38.1
N$48  (via drill 1.02)
  other vias: 35.56,38.1
N$49  (via drill 1.02)
  other vias: 33.02,38.1
N$50  (via drill 1.02)
  other vias: 55.88,48.26
N$51
  Top 0.406: J5.1 64.86,44.45 60.96,44.45 SL5.1
N$52
  Top 0.406: J5.3 64.86,46.99 60.96,46.99 SL5.3
N$53
  Top 0.406: J5.5 64.86,49.53 60.96,49.53 SL5.5
N$54  (via drill 1.02)
  other vias: 30.48,38.1
N$55  (via drill 1.02)
  other vias: 27.94,38.1
N$56  (via drill 1.02)
  other vias: 53.34,38.1
N$57  (via drill 1.02)
  other vias: 50.8,40.64
N$58  (via drill 1.02)
  other vias: 48.26,40.64
N$59  (via drill 1.02)
  other vias: 45.72,40.64
N$60  (via drill 1.02)
  other vias: 43.18,40.64
N$61  (via drill 1.02)
  other vias: 25.4,40.64
N$62  (via drill 1.02)
  other vias: 40.64,40.64
N$63  (via drill 1.02)
  other vias: 38.1,40.64
N$64  (via drill 1.02)
  other vias: 35.56,40.64
N$65  (via drill 1.02)
  other vias: 33.02,40.64
N$66  (via drill 1.02)
  other vias: 30.48,40.64
N$67  (via drill 1.02)
  other vias: 27.94,40.64
N$68  (via drill 1.02)
  other vias: 53.34,40.64
N$69  (via drill 1.02)
  other vias: 25.4,48.26
N$70  (via drill 1.02)
  other vias: 35.56,81.28
N$71  (via drill 1.02)
  other vias: 33.02,81.28
N$72  (via drill 1.02)
  other vias: 50.8,48.26
N$73  (via drill 1.02)
  other vias: 48.26,48.26
N$74  (via drill 1.02)
  other vias: 45.72,48.26
N$75  (via drill 1.02)
  other vias: 43.18,48.26
N$76  (via drill 1.02)
  other vias: 40.64,48.26
N$77  (via drill 1.02)
  other vias: 38.1,48.26
N$78  (via drill 1.02)
  other vias: 35.56,48.26
N$79  (via drill 1.02)
  other vias: 33.02,48.26
N$80  (via drill 1.02)
  other vias: 30.48,48.26
N$81  (via drill 1.02)
  other vias: 27.94,48.26
N$82  (via drill 1.02)
  other vias: 25.4,45.72
N$83  (via drill 1.02)
  other vias: 25.4,43.18
N$84  (via drill 1.02)
  other vias: 50.8,45.72
N$85  (via drill 1.02)
  other vias: 48.26,45.72
N$86  (via drill 1.02)
  other vias: 30.48,81.28
N$87  (via drill 1.02)
  other vias: 27.94,81.28
N$88  (via drill 1.02)
  other vias: 45.72,45.72
N$89  (via drill 1.02)
  other vias: 43.18,45.72
N$90  (via drill 1.02)
  other vias: 40.64,45.72
N$91  (via drill 1.02)
  other vias: 38.1,45.72
N$92  (via drill 1.02)
  other vias: 35.56,45.72
N$93  (via drill 1.02)
  other vias: 33.02,45.72
N$94  (via drill 1.02)
  other vias: 30.48,45.72
N$95  (via drill 1.02)
  other vias: 27.94,45.72
N$96  (via drill 1.02)
  other vias: 50.8,43.18
N$97  (via drill 1.02)
  other vias: 48.26,43.18
N$98  (via drill 1.02)
  other vias: 45.72,43.18
N$99  (via drill 1.02)
  other vias: 43.18,43.18
N$100  (via drill 1.02)
  other vias: 40.64,43.18
N$101  (via drill 1.02)
  other vias: 38.1,43.18
N$102  (via drill 1.02)
  other vias: 25.4,81.28
N$103  (via drill 1.02)
  other vias: 22.86,81.28
N$104  (via drill 1.02)
  other vias: 35.56,43.18
N$105  (via drill 1.02)
  other vias: 33.02,43.18
N$106  (via drill 1.02)
  other vias: 30.48,43.18
N$107  (via drill 1.02)
  other vias: 27.94,43.18
N$108  (via drill 1.02)
  other vias: 50.8,50.8
N$109  (via drill 1.02)
  other vias: 48.26,50.8
N$110  (via drill 1.02)
  other vias: 45.72,50.8
N$111  (via drill 1.02)
  other vias: 43.18,50.8
N$112  (via drill 1.02)
  other vias: 53.34,48.26
N$113  (via drill 1.02)
  other vias: 53.34,45.72
N$114  (via drill 1.02)
  other vias: 53.34,43.18
N$115  (via drill 1.02)
  other vias: 25.4,50.8
N$116  (via drill 1.02)
  other vias: 40.64,50.8
N$117  (via drill 1.02)
  other vias: 38.1,50.8
N$118  (via drill 1.02)
  other vias: 20.32,81.28
N$119  (via drill 1.02)
  other vias: 17.78,81.28
N$120  (via drill 1.02)
  other vias: 35.56,50.8
N$121  (via drill 1.02)
  other vias: 33.02,50.8
N$122  (via drill 1.02)
  other vias: 30.48,50.8
N$123  (via drill 1.02)
  other vias: 27.94,50.8
N$124  (via drill 1.02)
  other vias: 53.34,50.8
N$125  (via drill 1.02)
  other vias: 50.8,53.34
N$126  (via drill 1.02)
  other vias: 48.26,53.34
N$127  (via drill 1.02)
  other vias: 45.72,53.34
N$128  (via drill 1.02)
  other vias: 43.18,53.34
N$129  (via drill 1.02)
  other vias: 25.4,53.34
N$130  (via drill 1.02)
  other vias: 40.64,53.34
N$131  (via drill 1.02)
  other vias: 38.1,53.34
N$132  (via drill 1.02)
  other vias: 35.56,53.34
N$133  (via drill 1.02)
  other vias: 33.02,53.34
N$134  (via drill 1.02)
  other vias: 30.48,53.34
N$135  (via drill 1.02)
  other vias: 27.94,53.34
N$136  (via drill 1.02)
  other vias: 53.34,53.34
N$137  (via drill 1.02)
  other vias: 50.8,55.88
N$138  (via drill 1.02)
  other vias: 48.26,55.88
N$139  (via drill 1.02)
  other vias: 45.72,55.88
N$140  (via drill 1.02)
  other vias: 43.18,55.88
N$141  (via drill 1.02)
  other vias: 25.4,55.88
N$142  (via drill 1.02)
  other vias: 40.64,55.88
N$143  (via drill 1.02)
  other vias: 38.1,55.88
N$144  (via drill 1.02)
  other vias: 35.56,55.88
N$145  (via drill 1.02)
  other vias: 33.02,55.88
N$146  (via drill 1.02)
  other vias: 30.48,55.88
N$147  (via drill 1.02)
  other vias: 27.94,55.88
N$148  (via drill 1.02)
  other vias: 53.34,55.88
N$149  (via drill 1.02)
  other vias: 50.8,58.42
N$150  (via drill 1.02)
  other vias: 48.26,58.42
N$151  (via drill 1.02)
  other vias: 45.72,58.42
N$152  (via drill 1.02)
  other vias: 43.18,58.42
N$153  (via drill 1.02)
  other vias: 25.4,58.42
N$154  (via drill 1.02)
  other vias: 40.64,58.42
N$155  (via drill 1.02)
  other vias: 38.1,58.42
N$156  (via drill 1.02)
  other vias: 35.56,58.42
N$157  (via drill 1.02)
  other vias: 33.02,58.42
N$158  (via drill 1.02)
  other vias: 30.48,58.42
N$159  (via drill 1.02)
  other vias: 27.94,58.42
N$160  (via drill 1.02)
  other vias: 53.34,58.42
N$161  (via drill 1.02)
  other vias: 63.5,53.34
N$162  (via drill 1.02)
  other vias: 60.96,53.34
N$163  (via drill 1.02)
  other vias: 58.42,53.34
N$164  (via drill 1.02)
  other vias: 55.88,53.34
N$165  (via drill 1.02)
  other vias: 66.04,53.34
N$166  (via drill 1.02)
  other vias: 63.5,55.88
N$167  (via drill 1.02)
  other vias: 60.96,55.88
N$168  (via drill 1.02)
  other vias: 58.42,55.88
N$169  (via drill 1.02)
  other vias: 55.88,55.88
N$170  (via drill 1.02)
  other vias: 66.04,55.88
N$171  (via drill 1.02)
  other vias: 63.5,58.42
N$172  (via drill 1.02)
  other vias: 60.96,58.42
N$173  (via drill 1.02)
  other vias: 58.42,58.42
N$174  (via drill 1.02)
  other vias: 55.88,58.42
N$175  (via drill 1.02)
  other vias: 66.04,58.42
N$176  (via drill 1.02)
  other vias: 63.5,35.56
N$177  (via drill 1.02)
  other vias: 60.96,35.56
N$178  (via drill 1.02)
  other vias: 58.42,35.56
N$179  (via drill 1.02)
  other vias: 55.88,35.56
N$180  (via drill 1.02)
  other vias: 63.5,33.02
N$181  (via drill 1.02)
  other vias: 60.96,33.02
N$182  (via drill 1.02)
  other vias: 58.42,33.02
N$183  (via drill 1.02)
  other vias: 55.88,33.02
N$184  (via drill 1.02)
  other vias: 63.5,30.48
N$185  (via drill 1.02)
  other vias: 60.96,30.48
N$186  (via drill 1.02)
  other vias: 15.24,81.28
N$187  (via drill 1.02)
  other vias: 12.7,81.28
N$188  (via drill 1.02)
  other vias: 50.8,81.28
N$189  (via drill 1.02)
  other vias: 48.26,81.28
N$190  (via drill 1.02)
  other vias: 58.42,30.48
N$191  (via drill 1.02)
  other vias: 55.88,30.48
N$192  (via drill 1.02)
  other vias: 63.5,38.1
N$193  (via drill 1.02)
  other vias: 60.96,38.1
N$194  (via drill 1.02)
  other vias: 58.42,38.1
N$195  (via drill 1.02)
  other vias: 55.88,38.1
N$196  (via drill 1.02)
  other vias: 66.04,35.56
N$197  (via drill 1.02)
  other vias: 45.72,81.28
N$198  (via drill 1.02)
  other vias: 43.18,81.28
N$199  (via drill 1.02)
  other vias: 40.64,81.28
N$200  (via drill 1.02)
  other vias: 38.1,81.28
N$201  (via drill 1.02)
  other vias: 66.04,33.02
N$202  (via drill 1.02)
  other vias: 66.04,30.48
N$203  (via drill 1.02)
  other vias: 66.04,38.1
N$204  (via drill 1.02)
  other vias: 15.24,12.7
N$205  (via drill 1.02)
  other vias: 12.7,12.7
N$206  (via drill 1.02)
  other vias: 15.24,10.16
N$207  (via drill 1.02)
  other vias: 12.7,10.16
N$209  (via drill 1.02)
  other vias: 35.56,7.62
N$210  (via drill 1.02)
  other vias: 33.02,7.62
N$211  (via drill 1.02)
  other vias: 30.48,7.62
N$212  (via drill 1.02)
  other vias: 55.88,45.72
N$213  (via drill 1.02)
  other vias: 55.88,43.18
N$214  (via drill 1.02)
  other vias: 55.88,50.8
N$215  (via drill 1.02)
  other vias: 27.94,7.62
N$216  (via drill 1.02)
  other vias: 25.4,7.62
N$217  (via drill 1.02)
  other vias: 22.86,7.62
N$218  (via drill 1.02)
  other vias: 20.32,7.62
N$219  (via drill 1.02)
  other vias: 17.78,7.62
N$220  (via drill 1.02)
  other vias: 60.96,7.62
N$221  (via drill 1.02)
  other vias: 58.42,7.62
N$222  (via drill 1.02)
  other vias: 55.88,7.62
N$223  (via drill 1.02)
  other vias: 53.34,7.62
N$224  (via drill 1.02)
  other vias: 50.8,7.62
N$226  (via drill 1.02)
  other vias: 48.26,7.62
N$227  (via drill 1.02)
  other vias: 45.72,7.62
N$228  (via drill 1.02)
  other vias: 43.18,7.62
N$229  (via drill 1.02)
  other vias: 40.64,7.62
N$230  (via drill 1.02)
  other vias: 38.1,7.62
N$231  (via drill 1.02)
  other vias: 15.24,7.62
N$232  (via drill 1.02)
  other vias: 12.7,7.62
N$237  (via drill 1.02)
  other vias: 35.56,78.74
N$238  (via drill 1.02)
  other vias: 33.02,78.74
N$239  (via drill 1.02)
  other vias: 30.48,78.74
N$240  (via drill 1.02)
  other vias: 27.94,78.74
N$241  (via drill 1.02)
  other vias: 25.4,78.74
N$242  (via drill 1.02)
  other vias: 22.86,78.74
N$243  (via drill 1.02)
  other vias: 20.32,78.74
N$244  (via drill 1.02)
  other vias: 17.78,78.74
N$245  (via drill 1.02)
  other vias: 15.24,78.74
N$246  (via drill 1.02)
  other vias: 12.7,78.74
N$253  (via drill 1.02)
  other vias: 60.96,83.82
N$254  (via drill 1.02)
  other vias: 58.42,83.82
N$256  (via drill 1.02)
  other vias: 60.96,78.74
N$257  (via drill 1.02)
  other vias: 58.42,78.74
N$258  (via drill 1.02)
  other vias: 55.88,78.74
N$259  (via drill 1.02)
  other vias: 53.34,78.74
N$260  (via drill 1.02)
  other vias: 50.8,78.74
N$261  (via drill 1.02)
  other vias: 48.26,78.74
N$262  (via drill 1.02)
  other vias: 45.72,78.74
N$263  (via drill 1.02)
  other vias: 43.18,78.74
N$264  (via drill 1.02)
  other vias: 40.64,78.74
N$265  (via drill 1.02)
  other vias: 38.1,78.74
N$266  (via drill 1.02)
  other vias: 35.56,76.2
N$267  (via drill 1.02)
  other vias: 33.02,76.2
N$268  (via drill 1.02)
  other vias: 30.48,76.2
N$269  (via drill 1.02)
  other vias: 27.94,76.2
N$270  (via drill 1.02)
  other vias: 25.4,76.2
N$271  (via drill 1.02)
  other vias: 22.86,76.2
N$272  (via drill 1.02)
  other vias: 20.32,76.2
N$273  (via drill 1.02)
  other vias: 17.78,76.2
N$274  (via drill 1.02)
  other vias: 15.24,76.2
N$275  (via drill 1.02)
  other vias: 12.7,76.2
N$277  (via drill 1.02)
  other vias: 35.56,73.66
N$278  (via drill 1.02)
  other vias: 33.02,73.66
N$279  (via drill 1.02)
  other vias: 30.48,73.66
N$280  (via drill 1.02)
  other vias: 27.94,73.66
N$281  (via drill 1.02)
  other vias: 25.4,73.66
N$282  (via drill 1.02)
  other vias: 22.86,73.66
N$283  (via drill 1.02)
  other vias: 20.32,73.66
N$284  (via drill 1.02)
  other vias: 17.78,73.66
N$285  (via drill 1.02)
  other vias: 15.24,73.66
N$286  (via drill 1.02)
  other vias: 12.7,73.66
N$300  (via drill 1.02)
  other vias: 60.96,76.2
N$301  (via drill 1.02)
  other vias: 58.42,76.2
N$302  (via drill 1.02)
  other vias: 55.88,76.2
N$303  (via drill 1.02)
  other vias: 53.34,76.2
N$304  (via drill 1.02)
  other vias: 50.8,76.2
N$305  (via drill 1.02)
  other vias: 48.26,76.2
N$306  (via drill 1.02)
  other vias: 45.72,76.2
N$307  (via drill 1.02)
  other vias: 43.18,76.2
N$308  (via drill 1.02)
  other vias: 40.64,76.2
N$309  (via drill 1.02)
  other vias: 38.1,76.2
N$311  (via drill 1.02)
  other vias: 60.96,73.66
N$312  (via drill 1.02)
  other vias: 58.42,73.66
N$313  (via drill 1.02)
  other vias: 55.88,73.66
N$314  (via drill 1.02)
  other vias: 53.34,73.66
N$315  (via drill 1.02)
  other vias: 50.8,73.66
N$316  (via drill 1.02)
  other vias: 48.26,73.66
N$317  (via drill 1.02)
  other vias: 45.72,73.66
N$318  (via drill 1.02)
  other vias: 43.18,73.66
N$319  (via drill 1.02)
  other vias: 40.64,73.66
N$320  (via drill 1.02)
  other vias: 38.1,73.66
N$332  (via drill 1.02)
  other vias: 35.56,15.24
N$333  (via drill 1.02)
  other vias: 33.02,15.24
N$334  (via drill 1.02)
  other vias: 30.48,15.24
N$335  (via drill 1.02)
  other vias: 27.94,15.24
N$336  (via drill 1.02)
  other vias: 25.4,15.24
N$337  (via drill 1.02)
  other vias: 22.86,15.24
N$338  (via drill 1.02)
  other vias: 20.32,15.24
N$340  (via drill 1.02)
  other vias: 35.56,12.7
N$341  (via drill 1.02)
  other vias: 33.02,12.7
N$342  (via drill 1.02)
  other vias: 30.48,12.7
N$343  (via drill 1.02)
  other vias: 27.94,12.7
N$344  (via drill 1.02)
  other vias: 25.4,12.7
N$345  (via drill 1.02)
  other vias: 22.86,12.7
N$346  (via drill 1.02)
  other vias: 20.32,12.7
N$347  (via drill 1.02)
  other vias: 17.78,12.7
N$348  (via drill 1.02)
  other vias: 35.56,10.16
N$349  (via drill 1.02)
  other vias: 33.02,10.16
N$350  (via drill 1.02)
  other vias: 30.48,10.16
N$351  (via drill 1.02)
  other vias: 27.94,10.16
N$352  (via drill 1.02)
  other vias: 25.4,10.16
N$353  (via drill 1.02)
  other vias: 22.86,10.16
N$354  (via drill 1.02)
  other vias: 20.32,10.16
N$355  (via drill 1.02)
  other vias: 17.78,10.16
N$357  (via drill 1.02)
  other vias: 60.96,15.24
N$358  (via drill 1.02)
  other vias: 58.42,15.24
N$359  (via drill 1.02)
  other vias: 55.88,15.24
N$360  (via drill 1.02)
  other vias: 53.34,15.24
N$361  (via drill 1.02)
  other vias: 50.8,15.24
N$362  (via drill 1.02)
  other vias: 48.26,15.24
N$363  (via drill 1.02)
  other vias: 45.72,15.24
N$364  (via drill 1.02)
  other vias: 43.18,15.24
N$365  (via drill 1.02)
  other vias: 40.64,15.24
N$366  (via drill 1.02)
  other vias: 38.1,15.24
N$368  (via drill 1.02)
  other vias: 60.96,12.7
N$369  (via drill 1.02)
  other vias: 58.42,12.7
N$370  (via drill 1.02)
  other vias: 55.88,12.7
N$371  (via drill 1.02)
  other vias: 53.34,12.7
N$372  (via drill 1.02)
  other vias: 50.8,12.7
N$373  (via drill 1.02)
  other vias: 48.26,12.7
N$374  (via drill 1.02)
  other vias: 45.72,12.7
N$375  (via drill 1.02)
  other vias: 43.18,12.7
N$376  (via drill 1.02)
  other vias: 40.64,12.7
N$377  (via drill 1.02)
  other vias: 38.1,12.7
N$379  (via drill 1.02)
  other vias: 60.96,10.16
N$380  (via drill 1.02)
  other vias: 58.42,10.16
N$381  (via drill 1.02)
  other vias: 55.88,10.16
N$382  (via drill 1.02)
  other vias: 53.34,10.16
N$383  (via drill 1.02)
  other vias: 50.8,10.16
N$384  (via drill 1.02)
  other vias: 48.26,10.16
N$385  (via drill 1.02)
  other vias: 45.72,10.16
N$386  (via drill 1.02)
  other vias: 43.18,10.16
N$387  (via drill 1.02)
  other vias: 40.64,10.16
N$388  (via drill 1.02)
  other vias: 38.1,10.16
N$389  (via drill 1.02)
  other vias: 55.88,83.82
N$390  (via drill 1.02)
  other vias: 53.34,83.82
N$391  (via drill 1.02)
  other vias: 35.56,83.82
N$392  (via drill 1.02)
  other vias: 33.02,83.82
N$393  (via drill 1.02)
  other vias: 30.48,83.82
N$394  (via drill 1.02)
  other vias: 27.94,83.82
N$395  (via drill 1.02)
  other vias: 25.4,83.82
N$396  (via drill 1.02)
  other vias: 22.86,83.82
N$397  (via drill 1.02)
  other vias: 20.32,83.82
N$398  (via drill 1.02)
  other vias: 17.78,83.82
N$399  (via drill 1.02)
  other vias: 15.24,83.82
N$400  (via drill 1.02)
  other vias: 12.7,83.82
N$401  (via drill 1.02)
  other vias: 50.8,83.82
N$402  (via drill 1.02)
  other vias: 48.26,83.82
N$403  (via drill 1.02)
  other vias: 45.72,83.82
N$404  (via drill 1.02)
  other vias: 43.18,83.82
N$413  (via drill 1.02)
  other vias: 40.64,83.82
N$414  (via drill 1.02)
  other vias: 38.1,83.82
N$459  (via drill 1.02)
  other vias: 60.96,81.28
N$460  (via drill 1.02)
  other vias: 58.42,81.28
N$461  (via drill 1.02)
  other vias: 55.88,81.28
N$462  (via drill 1.02)
  other vias: 53.34,81.28
N$670  (via drill 1.02)
  other vias: 17.78,15.24
N$671  (via drill 1.02)
  other vias: 15.24,15.24
N$672  (via drill 1.02)
  other vias: 12.7,15.24
RESET
  Top 0.406: S1.2 9.67,14.75 11.68,16.76 17.53,16.76 17.91,17.14 21.59,17.14 22.61,18.16 22.61,26.92 23.5,27.81 23.5,64.77 24.77,66.04 34.29,66.04 35.56,67.31 J1.3
  Bottom 0.406: J1.3 SL1.3
RESVD
  Bottom 0.406: J1.1 SL1.1
SCL
  Bottom 0.406: SL3.10 J3.10
SCL2
  Top 0.406: SL15.51 77.47,13.97 86.98,13.97 H2.51
SCL_SYS
  Bottom 0.406: SL14.43 72.39,24.13 81.9,24.13 H1.43
SDA
  Bottom 0.406: J3.9 SL3.9
SDA2
  Top 0.406: SL15.49 77.47,16.51 86.98,16.51 H2.49
SDA_SYS
  Bottom 0.406: SL14.41 72.39,26.67 81.9,26.67 H1.41
VBATT45
  Top 0.406: SL15.45 77.47,21.59 86.98,21.59 H2.45
VBATT46
  Route15 0.406: SL15.46 80.01,21.59 89.52,21.59 H2.46
VCC_SYS
  Top 0.406: H2.28 H2.27 86.98,44.45 80.01,44.45 SL15.28 SL15.27
  Route15 0.406: SL12.2 67.31,76.2 69.85,78.74 78.11,78.74 78.74,79.38 | SL9.2 69.22,10.16 69.85,10.79 91.44,10.79 92.71,12.06 92.71,42.55 92.08,43.18 | 92.08,43.18 H2.28 | JP2.1 78.74,79.38 | 78.74,79.38 79.38,78.74 87.63,78.74 88.27,78.11 91.44,78.11 92.71,76.83 92.71,43.81 92.08,43.18
  Bottom 0.406: SL12.2 SL12.1 | SL9.1 SL9.2
VIN
  Bottom 0.406: J1.8 SL1.8

### Text on the board
tPlace: Freetronics ArduSat Arduino Adapter Module | v1.0 | by Jon Oxer | 5V | 5V | Arduino | CubeSat | 5V | 3V3 | 3V3 | 5V | POWER | ARDUINO | H1 | H2 | H1 | H2 | 3V3 | 3V3 | IO | RST | 5V | GND | A0 | A2 | A4 | REF | 3V3 | GND | VIN | A1 | A3 | A5 | 5V | ICSP | 5 | 6 | 3 | 4 | 5V | 1 | 2 | 3V3 | GND | SCL | AREF | D13 | D11 | D9 | D7 | D5 | D3 | D1 | SDA | GND | D12 | D10 | D8 | D6 | D4 | D2 | D0 | RESET | ARDUINO | 5V | 3V3 | 51 | 51 | CubeSat Bus | /Users/jon/Dropbox/Freetronics/ConsultingProjects/ArduSat/nanosatisfi 2-2 BW.bmp | www.freetronics.com/asaam | www.ardusat.org | freetronics
bPlace: 5V | H1 | H2 | 1 | 2 | 1 | 2 | 3V3 | IO | RST | 5V | GND | A0 | A2 | A4 | REF | 3V3 | GND | VIN | A1 | A3 | A5 | 5V | 5 | 6 | 3 | 4 | 1 | 2 | GND | SCL | AREF | D13 | D11 | D9 | D7 | D5 | D3 | D1 | SDA | GND | D12 | D10 | D8 | D6 | D4 | D2 | D0 | 5V | 51 | 52 | 51 | 52 | 3V3 | ROHS | Released under the TAPR / Open Hardware License / www.tapr.org/OHL | Copyright 2012 Freetronics Pty Ltd / www.freetronics.com/asaam / SKU: ASAAM
tNames: S1